# EAGLE design AccelBreakout (EAGLE 7.1.0)
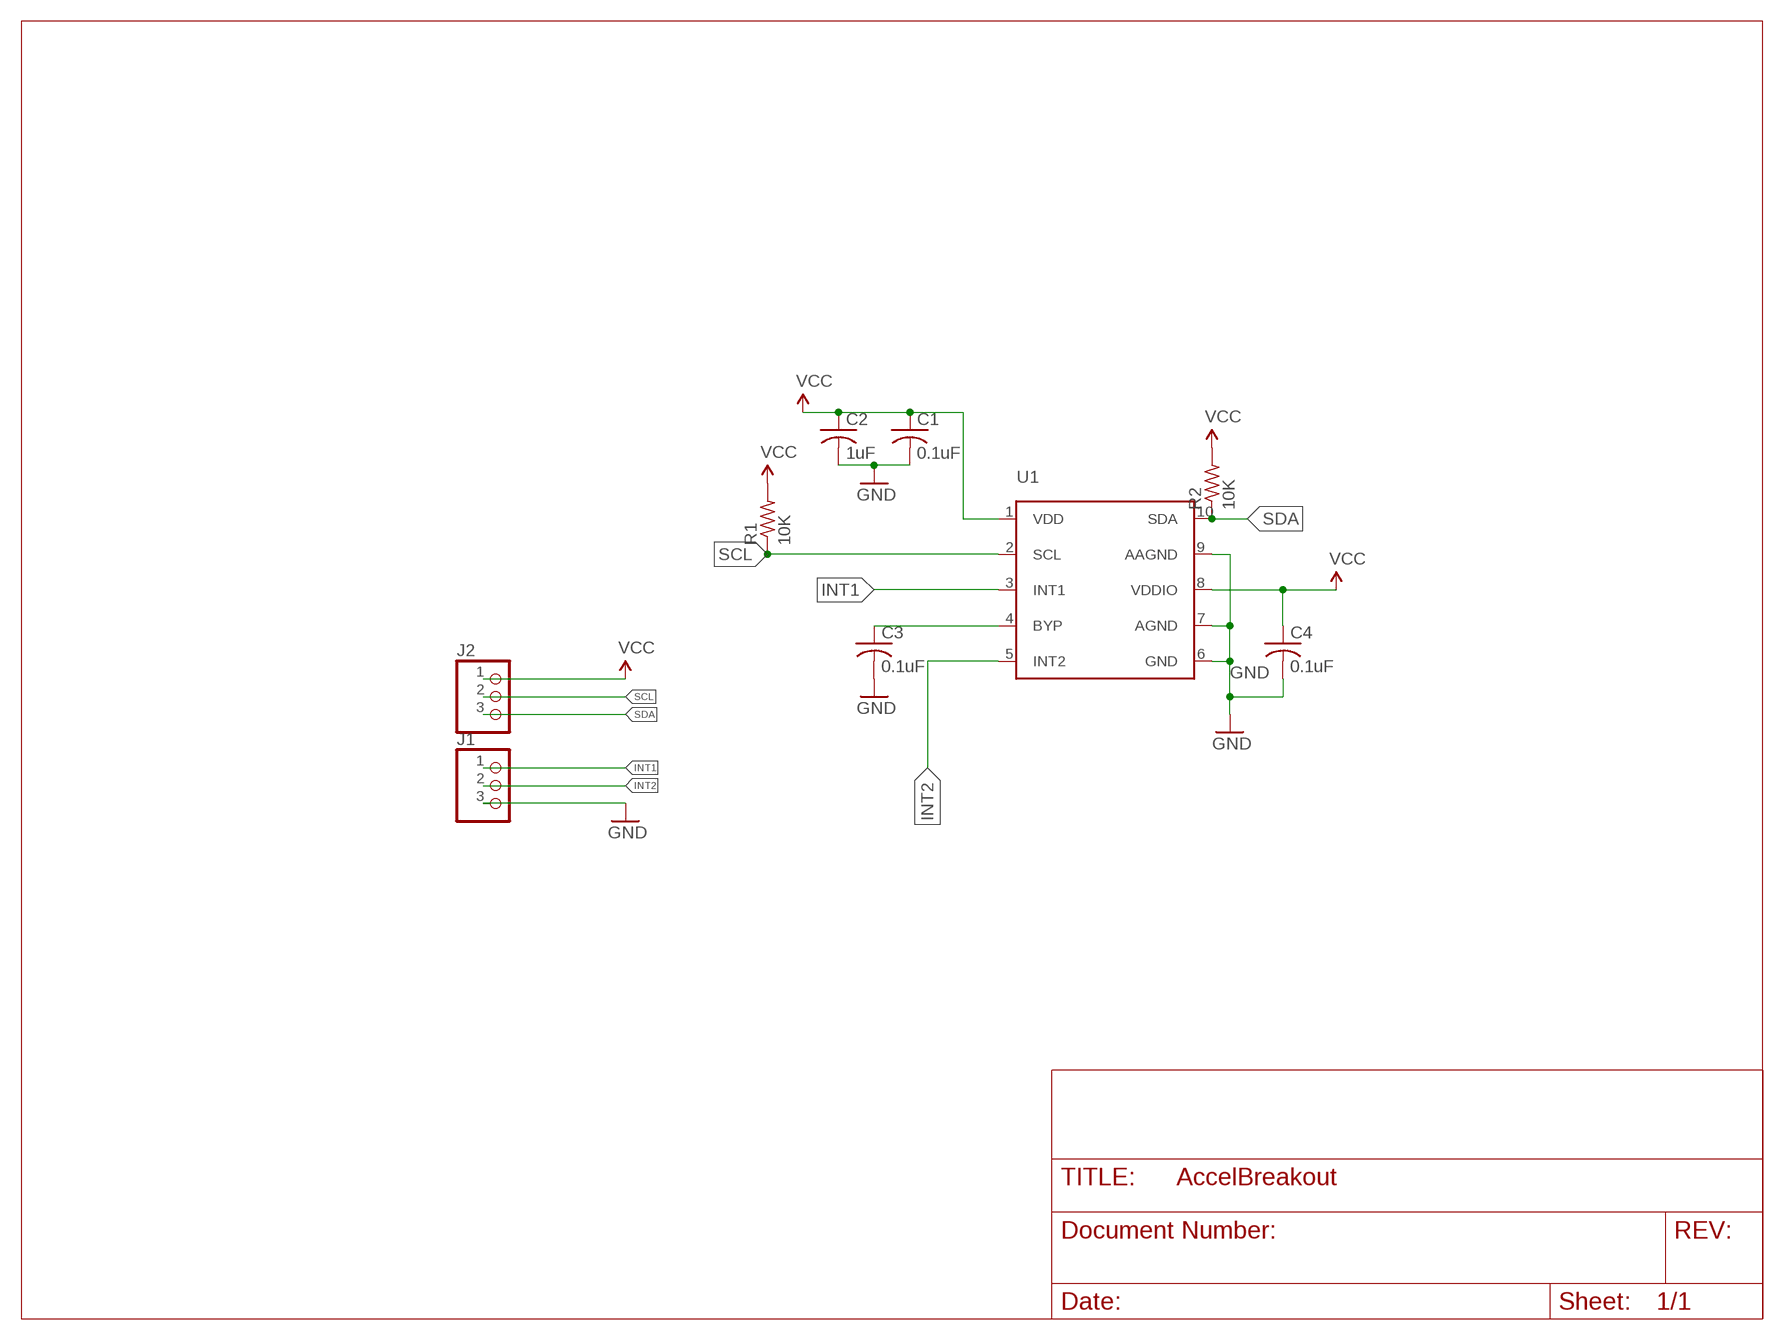
[diagram p0: schematic, sheet 1]

## Parts
C1  0.1uF  C-USC0603  [C0603]
C2  1uF  C-USC0603  [C0603]
C3  0.1uF  C-USC0603  [C0603]
C4  0.1uF  C-USC0603  [C0603]
J1  PINHD-1X3  [1X03]
J2  PINHD-1X3  [1X03]
R1  10K  R-US_R0603  [R0603]
R2  10K  R-US_R0603  [R0603]
U1  MMA8653FCR1  [MMA8653FCR1]

## Nets
GND: C1.2 C2.2 C3.2 C4.2 J1.3 U1.6(GND) U1.7(AGND) U1.9(AAGND)
INT1: J1.1 U1.3(INT1)
INT2: J1.2 U1.5(INT2)
N$34: C3.1 U1.4(BYP)
SCL: J2.2 R1.1 U1.2(SCL)
SDA: J2.3 R2.1 U1.10(SDA)
VCC: C1.1 C2.1 C4.1 J2.1 R1.2 R2.2 U1.1(VDD) U1.8(VDDIO)

## Library data of the parts
C1-C4 = AccelBreakout:C-US: CAPACITOR, American symbol
J1 J2 = AccelBreakout:PINHD-1X3: PIN HEADER
R1 R2 = AccelBreakout:R-US_: RESISTOR, American symbol
U1 = AccelBreakout:MMA8653FCR1

## Board
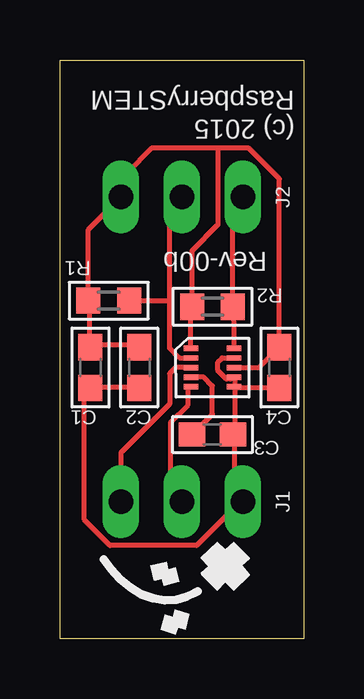
[diagram p1: board, top side]
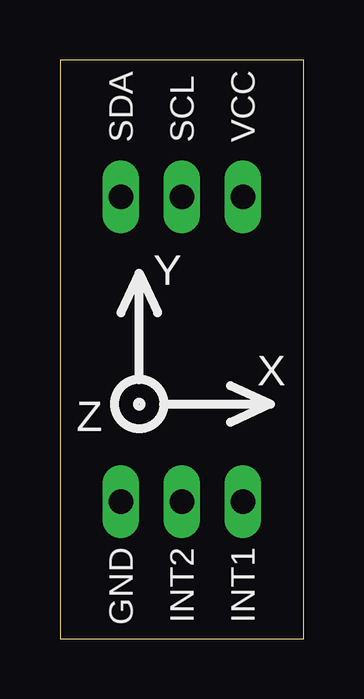
[diagram p2: board, bottom side, seen from below]

Size 10.16 x 24.13 mm. Coordinates in mm from the lower left corner, seen from the top.
Outline: 10.16,0 0,0 0,24.13 10.16,24.13 10.16,0
Copper layers (1*16): Top 0.0356mm / dielectric 1.5011mm / Bottom 0.0356mm
Design rules "LaenPCBOrder *": minimum track width 8mil, minimum drill 13mil, track to track 6mil, track to pad 6mil, pad to pad 6mil, via to via 6mil, smd to smd 6mil, copper to edge 15mil, drill to drill 6mil, minimum pad ring 7mil, minimum via ring 7mil, stop-mask expansion 3mil, vias tented up to drill 0mil, thermal gap 10mil

### Footprints (pad centres in the part's own frame; a part is rotated, then mirrored left to right if it is on the bottom)
C0603 = smd 1.1 x 1: 1 -0.85,0; 2 0.85,0
1X03 = drill 1.016 long: 1 -2.54,0; 2 0,0; 3 2.54,0
R0603 = smd 1 x 1.1: 1 -0.85,0; 2 0.85,0
MMA8653FCR1 = smd 0.6 x 0.225: 1 -0.9,0.8; 2 -0.9,0.4; 3 -0.9,0; 4 -0.9,-0.4; 5 -0.9,-0.8; 6 0.9,-0.8; 7 0.9,-0.4; 8 0.9,0; 9 0.9,0.4; 10 0.9,0.8

### Placement (x,y rotation side)
C1  1.27,11.3 270 top
C2  3.3,11.3 270 top
C3  6.35,8.51 0 top
C4  9.14,11.3 270 top
J1  5.08,5.71 0 top
J2  5.08,18.41 0 top
R1  2.03,14.1 180 top
R2  6.35,13.84 180 top
U1  6.35,11.3 0 top

### Tracks (layer width: path | path; a pad name or v marks a point on that pad's centre or on a via)
GND
  Top 0.203: 7.29,10.46 7.29,10.82 U1.7 7.11,10.82 6.93,10.82 6.58,11.18 6.58,11.53 6.76,11.71 7.11,11.71 U1.9 | 7.29,10.46 7.29,8.51 | 7.29,10.46 9.07,10.46 C4.2 | 7.29,10.46 U1.6 | 3.38,10.29 C2.2 3.2,10.46 1.42,10.46 C1.2 1.02,10.2 1.02,4.95 2.08,3.89 5.69,3.89 7.47,5.66 J1.3 7.47,5.84 7.29,6.02 7.29,8.51 | 7.29,8.51 C3.2
INT1
  Top 0.203: U1.3 4.83,11.3 4.57,11.05 4.57,9.78 2.54,7.75 J1.1
INT2
  Top 0.203: U1.5 5.33,10.46 5.33,9.75 4.62,9.04 4.62,6.2 4.98,5.84 J1.2
N$34
  Top 0.203: C3.1 6.35,9.36 6.35,10.54 5.99,10.9 U1.4
SCL
  Top 0.203: U1.2 5.33,11.71 4.98,11.71 4.57,12.12 4.57,14.1 | 4.57,14.1 4.57,17.91 J2.2 | R1.1 4.57,14.1
SDA
  Top 0.203: 7.64,18.41 J2.3 7.2,18 R2.1 7.25,13.13 U1.10
VCC
  Top 0.203: 6.58,20.45 7.87,20.45 9.14,19.18 C4.1 8.29,11.3 U1.8 | 6.58,20.45 3.81,20.45 2.79,19.43 2.79,18.67 J2.1 | C2.1 3.2,12.24 1.42,12.24 C1.1 1.25,12.24 1.25,14.16 R1.2 1.18,17.06 J2.1 | 6.58,20.45 6.58,17.26 5.5,16.18 R2.2 5.45,13.79 U1.1 | 2.49,18.41 J2.1

### Text on the board
tPlace: (c) 2015 / RaspberrySTEM | Rev-00b
bPlace: VCC | SCL | SDA | Y | X | Z | INT1 | INT2 | GND